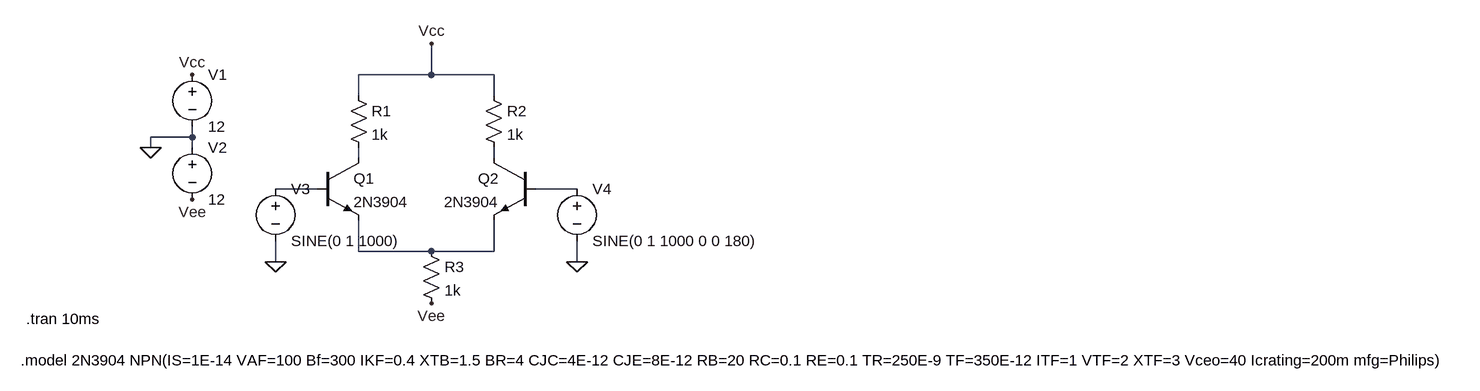
[diagram p0: schematic differenziale a transistor.asc]
differenziale a transistor.asc, the LTspice schematic file:
Version 4
SHEET 1 1780 680
WIRE 224 80 224 32
WIRE 224 80 112 80
WIRE 320 80 224 80
WIRE 112 112 112 80
WIRE 320 112 320 80
WIRE -144 176 -144 160
WIRE -144 176 -208 176
WIRE -208 192 -208 176
WIRE -144 192 -144 176
WIRE 112 208 112 192
WIRE 320 208 320 192
WIRE 48 256 -16 256
WIRE 448 256 384 256
WIRE 112 352 112 304
WIRE 224 352 112 352
WIRE 320 352 320 304
WIRE 320 352 224 352
WIRE -16 368 -16 336
WIRE 448 368 448 336
FLAG -208 192 0
FLAG -144 80 Vcc
FLAG -144 272 Vee
FLAG 224 32 Vcc
FLAG 224 432 Vee
FLAG -16 368 0
FLAG 448 368 0
SYMBOL npn 48 208 R0
SYMATTR InstName Q1
SYMATTR Value 2N3904
SYMBOL npn 384 208 M0
SYMATTR InstName Q2
SYMATTR Value 2N3904
SYMBOL res 96 96 R0
SYMATTR InstName R1
SYMATTR Value 1k
SYMBOL res 304 96 R0
SYMATTR InstName R2
SYMATTR Value 1k
SYMBOL res 208 336 R0
SYMATTR InstName R3
SYMATTR Value 1k
SYMBOL voltage -144 64 R0
SYMATTR InstName V1
SYMATTR Value 12
SYMBOL voltage -144 176 R0
SYMATTR InstName V2
SYMATTR Value 12
SYMBOL voltage -16 240 R0
SYMATTR InstName V3
SYMATTR Value SINE(0 1 1000)
SYMBOL voltage 448 240 R0
SYMATTR InstName V4
SYMATTR Value SINE(0 1 1000 0 0 180)
TEXT -408 520 Left 2 !.model 2N3904 NPN(IS=1E-14 VAF=100 Bf=300 IKF=0.4 XTB=1.5 BR=4 CJC=4E-12 CJE=8E-12 RB=20 RC=0.1 RE=0.1 TR=250E-9 TF=350E-12 ITF=1 VTF=2 XTF=3 Vceo=40 Icrating=200m mfg=Philips)
TEXT -400 456 Left 2 !.tran 10ms

The netlist it stands for:
* differenziale a transistor.asc
Q1 N001 N003 N005 0 2N3904
Q2 N002 N004 N005 0 2N3904
R1 Vcc N001 1k
R2 Vcc N002 1k
R3 N005 Vee 1k
V1 Vcc 0 12
V2 0 Vee 12
V3 N003 0 SINE(0 1 1000)
V4 N004 0 SINE(0 1 1000 0 0 180)
.model NPN NPN
.model PNP PNP
.lib standard.bjt
.model 2N3904 NPN(IS=1E-14 VAF=100 Bf=300 IKF=0.4 XTB=1.5 BR=4 CJC=4E-12 CJE=8E-12 RB=20 RC=0.1 RE=0.1 TR=250E-9 TF=350E-12 ITF=1 VTF=2 XTF=3 Vceo=40 Icrating=200m mfg=Philips)
.tran 10ms
.backanno
.end